# EAGLE design vr2 (EAGLE 4.16)
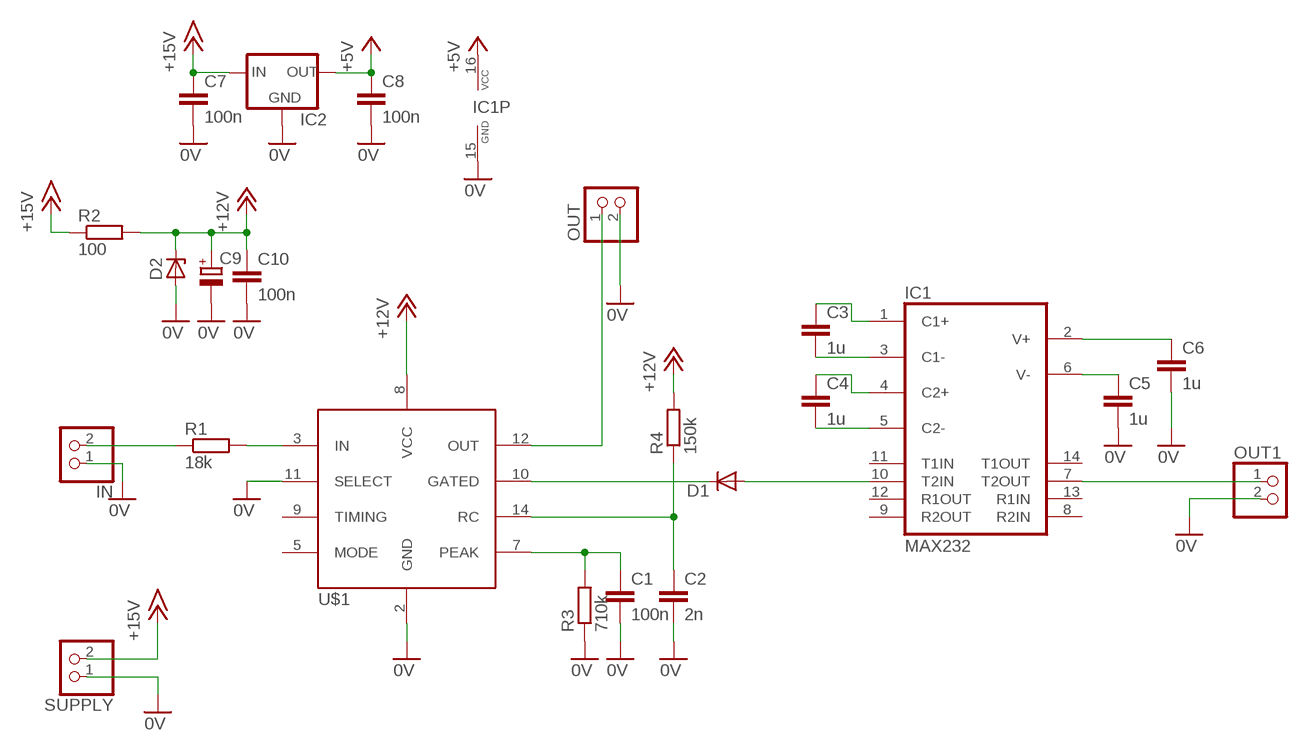
[diagram p0: schematic, sheet 1]

## Parts
C1  100n  C-EU102-043X133  [C102-043X133]
C2  2n  C-EU025-024X044  [C025-024X044]
C3  1u  C-EU050-045X075  [C050-045X075]
C4  1u  C-EU050-045X075  [C050-045X075]
C5  1u  C-EU050-045X075  [C050-045X075]
C6  1u  C-EU050-045X075  [C050-045X075]
C7  100n  C-EU025-024X044  [C025-024X044]
C8  100n  C-EU025-024X044  [C025-024X044]
C9  CPOL-EUE2-4  [E2-4]
C10  100n  C-EU025-024X044  [C025-024X044]
D1  DIODE-D-7.5  [D-7.5]
D2  ZENER-DIODEZD-2.5  [ZDIO-2.5]
IC1  MAX232  [DIL16]
IC2  78LXX  [78LXX]
IN  PINHD-1X2  [1X02]
OUT  PINHD-1X2  [1X02]
OUT1  PINHD-1X2  [1X02]
R1  18k  R-EU_0204/5  [0204/5]
R2  100  R-EU_0204/7  [0204/7]
R3  710k  R-EU_0204/7  [0204/7]
R4  150k  R-EU_0204/5  [0204/5]
SUPPLY  PINHD-1X2  [1X02]
U$1  LM1815  [DIL14]

## Nets
0V: C1.2 C2.2 C5.2 C6.2 C7.2 C8.2 C9.- C10.2 D2.A IC1.15(GND) IC2.GND IN.1 OUT1.2 OUT.2 R3.1 SUPPLY.1 U$1.2(GND) U$1.11(SELECT)
+5V: C8.1 IC1.16(VCC) IC2.OUT
+12V: C9.+ C10.1 D2.C R2.2 R4.2 U$1.8(VCC)
+15V: C7.1 IC2.IN R2.1 SUPPLY.2
N$1: R1.2 U$1.3(IN)
N$2: OUT.1 U$1.12(OUT)
N$3: C1.1 R3.2 U$1.7(PEAK)
N$4: C4.2 IC1.5(C2-)
N$5: C2.1 R4.1 U$1.14(RC)
N$6: IN.2 R1.1
N$7: C4.1 IC1.4(C2+)
N$8: C3.2 IC1.3(C1-)
N$9: C3.1 IC1.1(C1+)
N$10: C6.1 IC1.2(V+)
N$11: C5.1 IC1.6(V-)
N$12: D1.C U$1.10(GATED)
N$13: D1.A IC1.10(T2IN)
N$14: IC1.7(T2OUT) OUT1.1
Unconnected: IC1.8(R2IN) IC1.9(R2OUT) IC1.11(T1IN) IC1.12(R1OUT) IC1.13(R1IN) IC1.14(T1OUT) U$1.5(MODE) U$1.9(TIMING)

## Library data of the parts
C1-C8 C10 = rcl:C-EU: CAPACITOR, European symbol
C9 = rcl:CPOL-EU: POLARIZED CAPACITOR, European symbol
D1 = diode:DIODE-: DIODE
D2 = diode:ZENER-DIODE: Z-Diode
IC1 = maxim:MAX232: RS232 TRANSEIVER
IC2 = v-reg:78LXX: VOLTAGE REGULATOR
IN OUT OUT1 SUPPLY = pinhead:PINHD-1X2: PIN HEADER
R1-R4 = rcl:R-EU_: RESISTOR, European symbol
U$1 = rnie04:LM1815

## Board
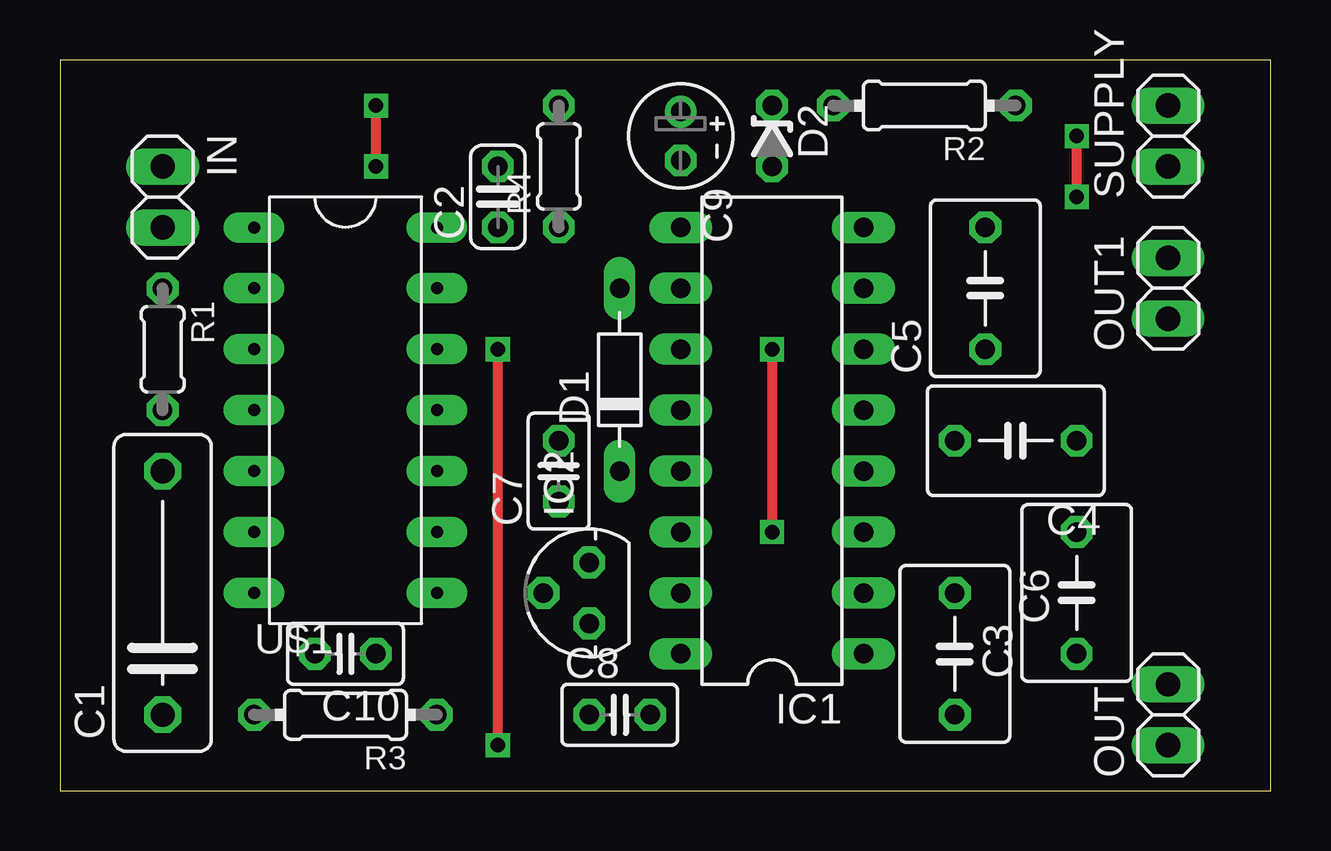
[diagram p1: board, top side]
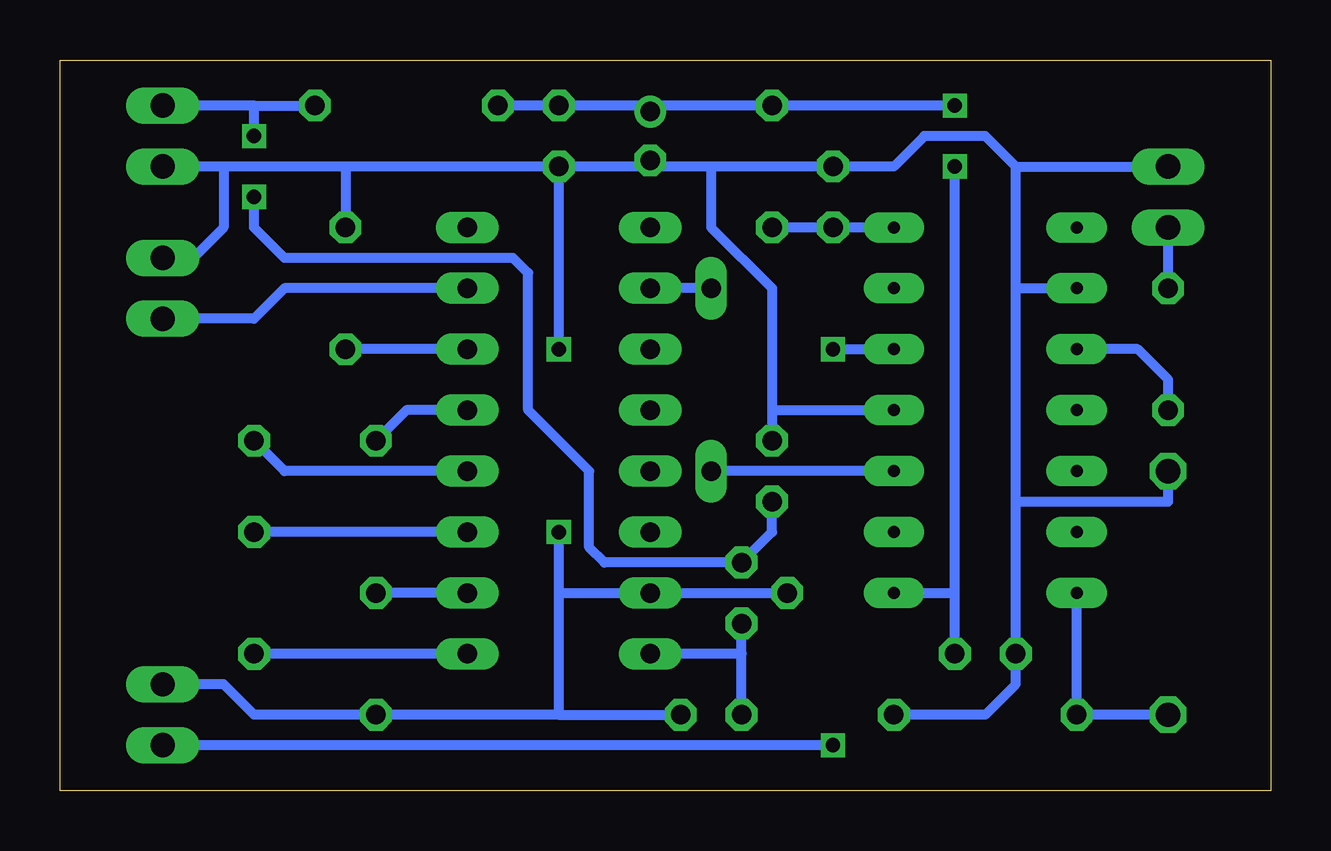
[diagram p2: board, bottom side, seen from below]

Size 50.47 x 30.47 mm. Coordinates in mm from the lower left corner, seen from the top.
Outline: 0,0 50.47,0 50.47,30.47 0,30.47 0,0
Copper layers (1*16): Top 0.035mm / dielectric 1.5mm / Bottom 0.035mm
Design rules "default": minimum track width 10mil, minimum drill 24mil, track to track 8mil, track to pad 8mil, pad to pad 8mil, via to via 8mil, smd to smd 8mil, copper to edge 40mil, drill to drill 8mil, minimum pad ring 10mil, minimum via ring 8mil, stop-mask expansion 4mil, vias tented up to drill 0mil, thermal gap 10mil

### Footprints (pad centres in the part's own frame; a part is rotated, then mirrored left to right if it is on the bottom)
C102-043X133 = drill 1.016 octagon: 1 -5.08,0; 2 5.08,0
C025-024X044 = drill 0.813 octagon: 1 -1.27,0; 2 1.27,0
C050-045X075 = drill 0.813 octagon: 1 -2.54,0; 2 2.54,0
C025-025X050 = drill 0.813 octagon: 1 -1.27,0; 2 1.27,0
E2-4 = drill 0.813 pad 1.27 round: + -1.016,0 | drill 0.813 pad 1.27 octagon: - 1.016,0
D-7.5 = drill 0.813 long: A 3.81,0; C -3.81,0
ZDIO-2.5 = drill 0.813 octagon: A 1.27,0; C -1.27,0
DIL16 = drill 0.813 long: 1 -8.89,-3.81; 2 -6.35,-3.81; 3 -3.81,-3.81; 4 -1.27,-3.81; 5 1.27,-3.81; 6 3.81,-3.81; 7 6.35,-3.81; 8 8.89,-3.81; 9 8.89,3.81; 10 6.35,3.81; 11 3.81,3.81; 12 1.27,3.81; 13 -1.27,3.81; 14 -3.81,3.81; 15 -6.35,3.81; 16 -8.89,3.81
78LXX = drill 0.813 octagon: GND 0,1.905; IN 1.27,0; OUT -1.27,0
1X02 = drill 1.016 long: 1 -1.27,0; 2 1.27,0
0204/5 = drill 0.813 octagon: 1 -2.54,0; 2 2.54,0
0204/7 = drill 0.813 octagon: 1 -3.81,0; 2 3.81,0
DIL14 = drill 0.5 pad 1.27 long: 1 -3.81,7.62; 2 -3.81,5.08; 3 -3.81,2.54; 4 -3.81,0; 5 -3.81,-2.54; 6 -3.81,-5.08; 7 -3.81,-7.62; 8 3.81,-7.62; 9 3.81,-5.08; 10 3.81,-2.54; 11 3.81,0; 12 3.81,2.54; 13 3.81,5.08; 14 3.81,7.62

### Placement (x,y rotation side)
C1  4.28,8.25 90 top
C2  18.25,24.76 90 top
C3  42.38,8.25 90 top
C4  39.84,14.6 180 top
C5  38.57,20.95 90 top
C6  37.3,5.71 270 top
C7  100n  [C025-025X050]  20.79,13.33 90 top
C8  100n  [C025-025X050]  23.33,3.17 0 top
C9  25.87,27.3 270 top
C10  100n  [C025-025X050]  11.9,5.71 180 top
D1  23.33,17.14 90 top
D2  29.68,27.3 270 top
IC1  29.68,14.6 90 top
IC2  22.06,8.25 90 top
IN  4.28,24.76 270 top
OUT  46.19,3.17 90 top
OUT1  46.19,20.95 90 top
R1  4.28,18.41 270 top
R2  36.03,28.57 180 top
R3  11.9,3.17 180 top
R4  20.79,26.03 90 top
SUPPLY  46.19,27.3 90 top
U$1  11.9,15.87 0 top

### Tracks (layer width: path | path; a pad name or v marks a point on that pad's centre or on a via)
0V  (via drill 0.6)
  Top 0.406: v29.68,18.41 v29.68,10.79
  Bottom 0.406: 10.63,20.95 U$1.2 | 10.63,26.03 11.9,27.3 14.44,27.3 15.71,26.03 C2.2 23.33,26.03 | 10.63,20.95 10.63,26.03 | 29.68,3.17 C6.2 42.38,3.17 43.65,4.44 OUT.2 | 29.68,8.25 29.68,3.17 | 29.68,8.25 IC1.15 IC2.GND | 23.33,26.03 25.87,26.03 | 10.63,26.03 IN.1 | 29.68,3.17 C8.2 | D2.A 38.57,26.03 | 38.57,26.03 43.65,26.03 | 43.65,26.03 SUPPLY.1 | D2.A v29.68,18.41 | v29.68,10.79 29.68,8.25 | 38.57,26.03 C5.2 | 25.87,26.03 C9.- | 25.87,26.03 D2.A | 20.79,15.87 C7.2 | OUT1.2 44.92,22.22 43.65,23.49 43.65,26.03 | 10.63,12.06 C10.2 10.63,4.44 11.9,3.17 R3.1 | 10.63,12.06 10.63,20.95 | C1.2 4.28,12.06 10.63,12.06 | 20.79,15.87 U$1.11 | 20.79,15.87 20.79,20.95 23.33,23.49 23.33,26.03
+5V
  Bottom 0.406: 22.06,5.71 IC2.OUT | 22.06,5.71 IC1.16 | C8.1 22.06,5.71
+12V  (via drill 0.6)
  Top 0.406: v13.17,26.03 v13.17,28.57
  Bottom 0.406: R2.2 D2.C 25.87,28.57 | 25.87,28.57 R4.2 v13.17,28.57 | 25.87,28.57 C9.+ | C10.1 13.17,8.25 | U$1.8 13.17,8.25 | 13.17,8.25 v13.17,26.03
+15V  (via drill 0.6)
  Top 0.406: v42.38,24.76 v42.38,27.3
  Bottom 0.406: 42.38,28.57 R2.1 | 42.38,28.57 SUPPLY.2 | C7.1 20.79,10.79 IC2.IN 27.78,9.52 28.41,10.15 28.41,13.33 30.95,15.87 30.95,21.59 31.58,22.22 41.11,22.22 42.38,23.49 v42.38,24.76 | v42.38,27.3 42.38,28.57
N$1
  Bottom 0.406: R1.2 4.28,17.14 5.55,18.41 U$1.3
N$2  (via drill 0.6)
  Top 0.406: v18.25,1.9 v18.25,18.41
  Bottom 0.406: v18.25,18.41 U$1.12 | v18.25,1.9 OUT.1
N$3
  Bottom 0.406: C1.1 R3.2 U$1.7
N$4
  Bottom 0.406: IC1.5 36.03,15.87 C4.2
N$5
  Bottom 0.406: U$1.14 C2.1 R4.1
N$6
  Bottom 0.406: R1.1 IN.2
N$7
  Bottom 0.406: IC1.4 41.11,13.33 C4.1
N$8
  Bottom 0.406: IC1.3 C3.2
N$9
  Bottom 0.406: IC1.1 C3.1
N$10
  Bottom 0.406: IC1.2 C6.1
N$11
  Bottom 0.406: IC1.6 C5.1
N$12
  Bottom 0.406: U$1.10 D1.C
N$13
  Bottom 0.406: D1.A IC1.10
N$14
  Bottom 0.406: IC1.7 41.11,20.95 42.38,19.68 OUT1.1